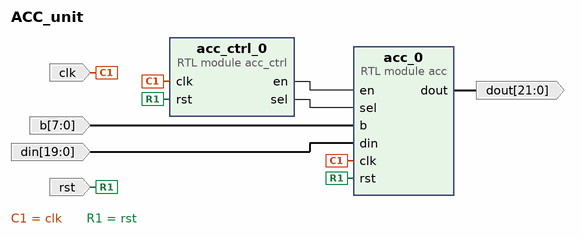
[diagram p0: block diagram of the top level]
# Vivado block design ACC_unit, xc7a12tcpg238-3, Vivado 2023.2
create_bd_design ACC_unit

create_bd_port -dir I clk
create_bd_port -dir I rst
create_bd_port -dir I -from 19 -to 0 din
create_bd_port -dir I -from 7 -to 0 b
create_bd_port -dir O -from 21 -to 0 dout

create_bd_cell -type module -reference acc_ctrl acc_ctrl_0
create_bd_cell -type module -reference acc acc_0

# ---- connections ----

connect_bd_net [get_bd_pins acc_0/dout] [get_bd_ports dout]
connect_bd_net [get_bd_pins acc_ctrl_0/en] [get_bd_pins acc_0/en]
connect_bd_net [get_bd_pins acc_ctrl_0/sel] [get_bd_pins acc_0/sel]
connect_bd_net [get_bd_ports b] [get_bd_pins acc_0/b]
connect_bd_net [get_bd_ports clk] [get_bd_pins acc_0/clk] [get_bd_pins acc_ctrl_0/clk]
connect_bd_net [get_bd_ports din] [get_bd_pins acc_0/din]
connect_bd_net [get_bd_ports rst] [get_bd_pins acc_0/rst] [get_bd_pins acc_ctrl_0/rst]

validate_bd_design
save_bd_design
